# EAGLE design dac-eval-simplified (EAGLE 7.3.0)

## Sheet 1 of 2
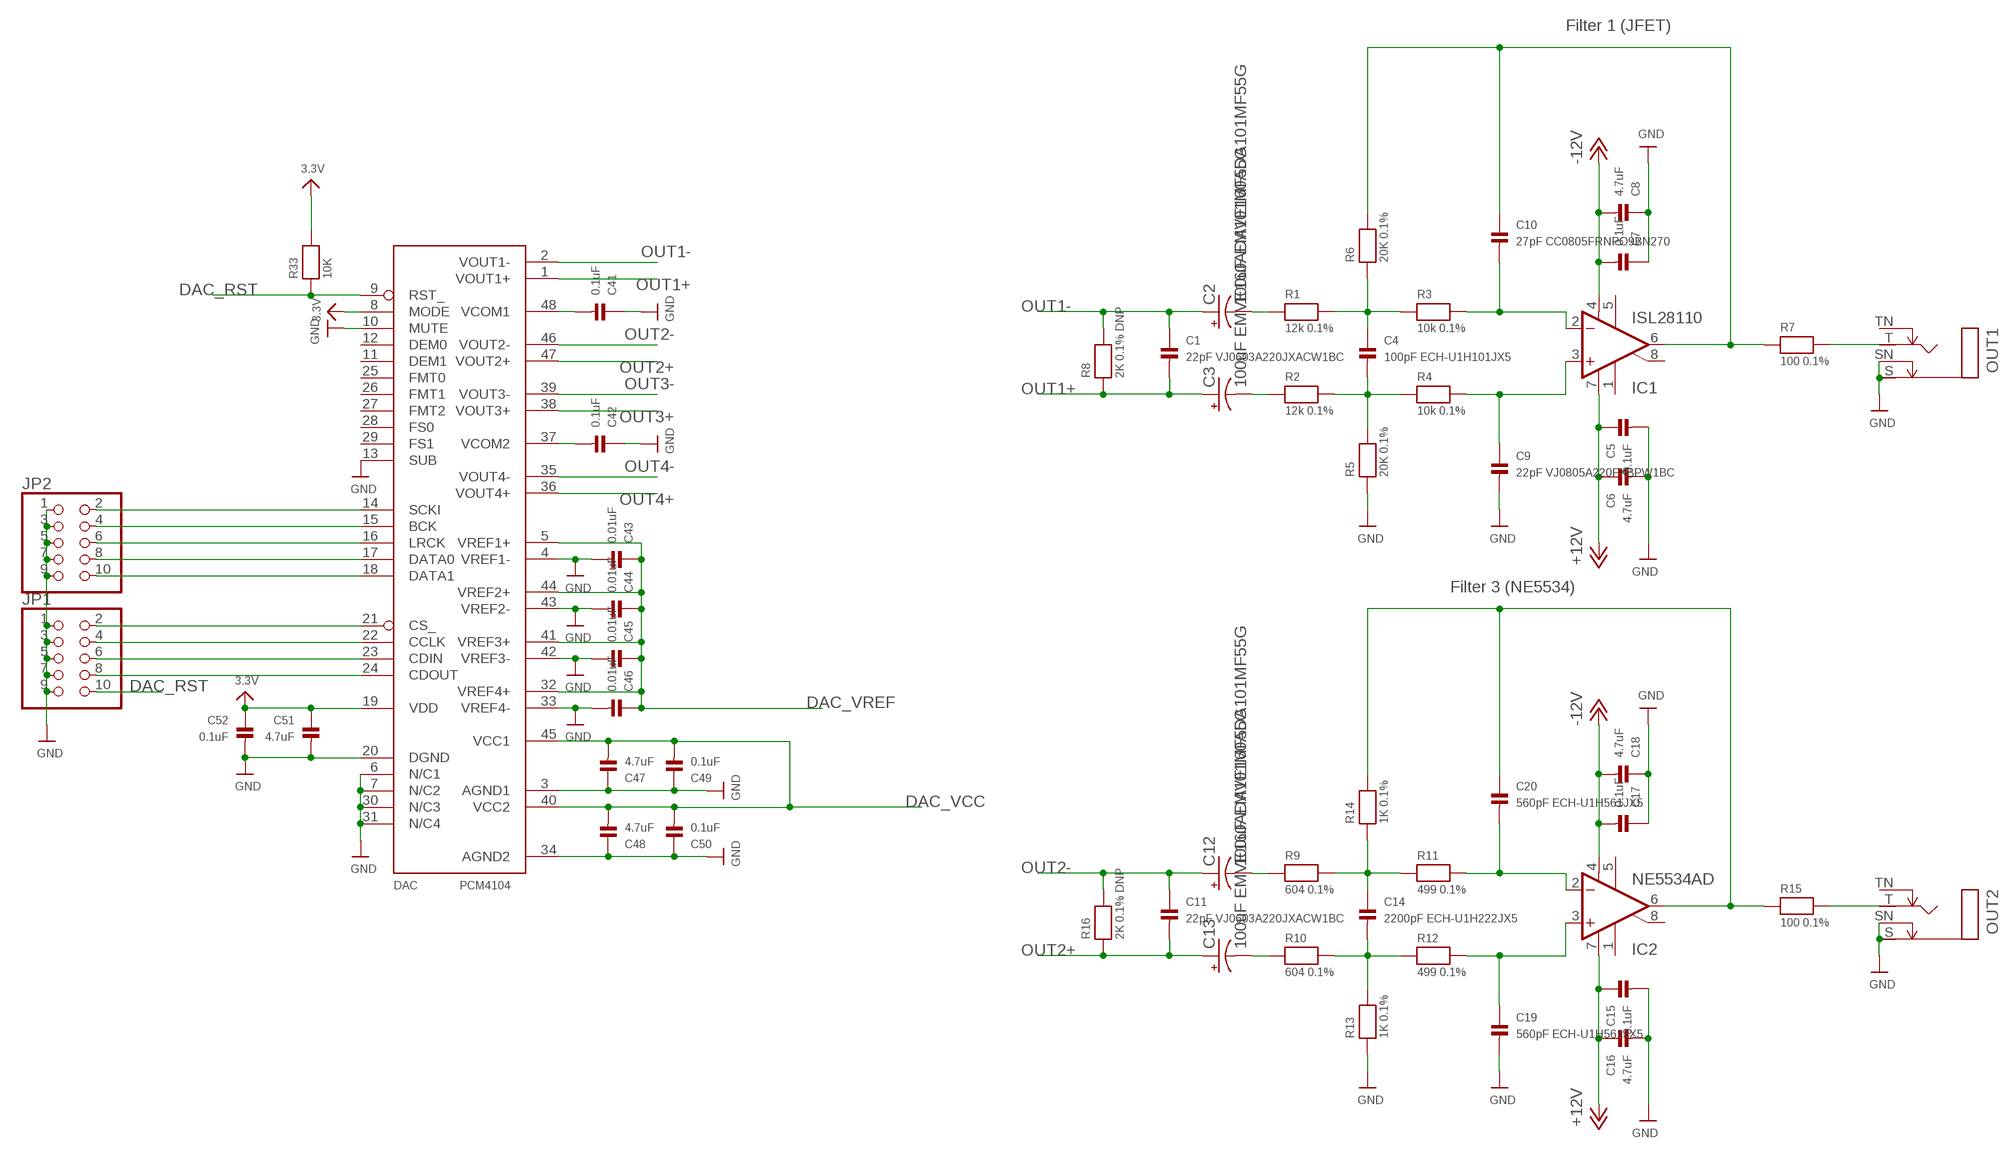
[diagram p0: schematic, sheet 1, part 1 of 2]
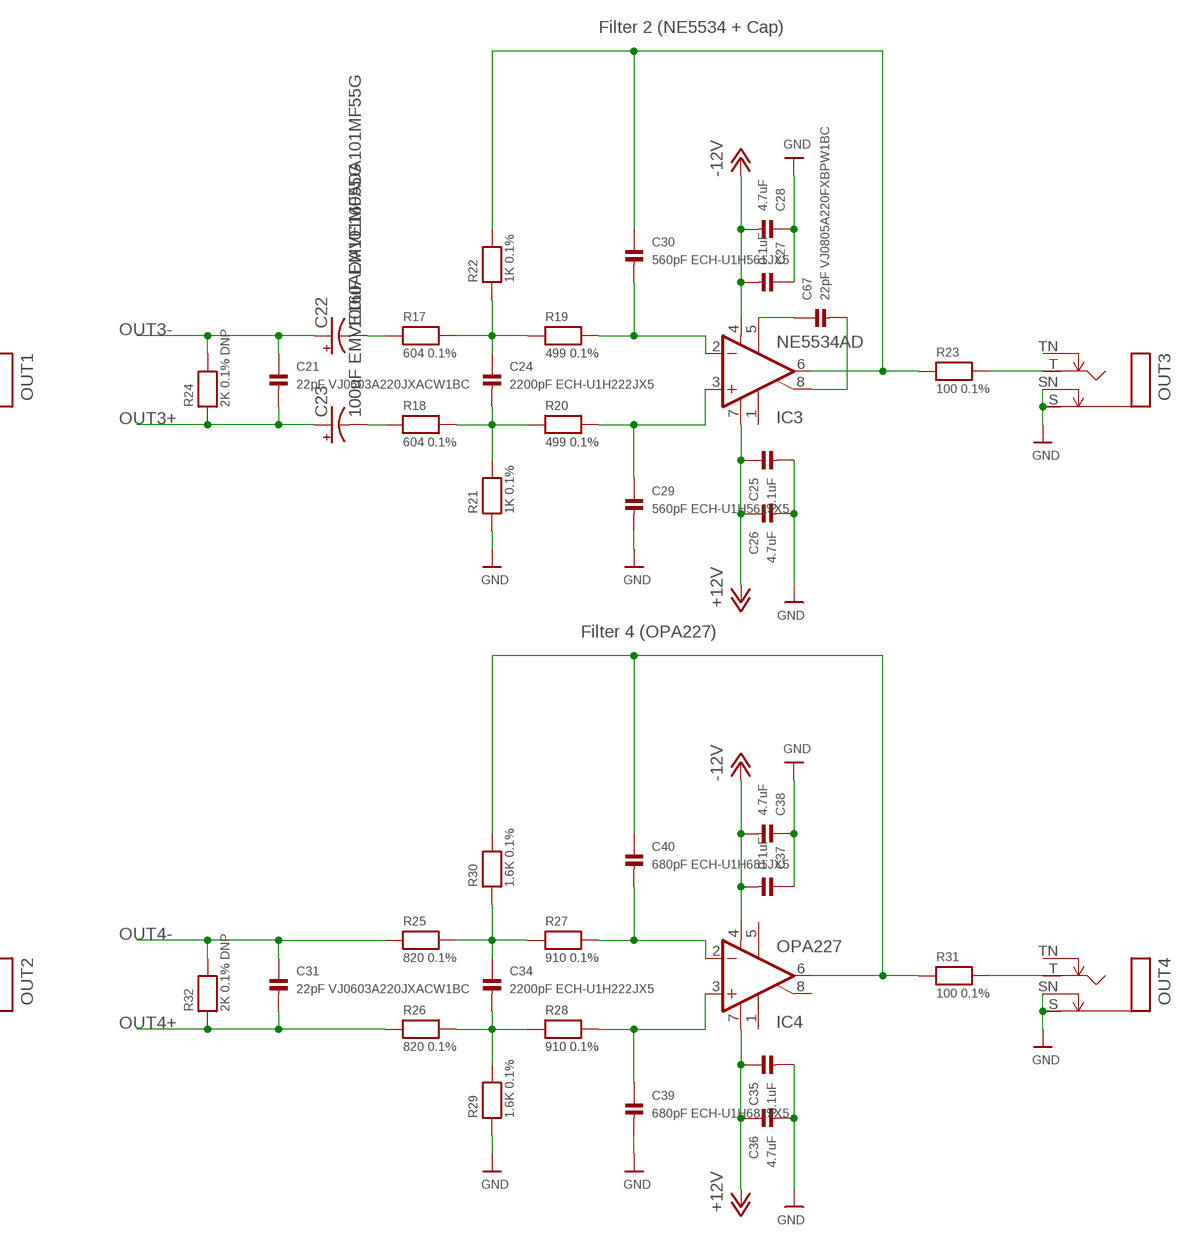
[diagram p1: schematic, sheet 1, part 2 of 2]

### Parts
C1  22pF VJ0603A220JXACW1BC  CAP_CERAMIC0603  [0603]
C2  100uF EMVE160ADA101MF55G  CAP_POLD  [PANASONIC_D]
C3  100uF EMVE160ADA101MF55G  CAP_POLD  [PANASONIC_D]
C4  100pF ECH-U1H101JX5  CAP_CERAMIC0805  [0805]
C5  0.1uF  CAP_CERAMIC0603  [0603]
C6  4.7uF  CAP_CERAMIC0603  [0603]
C7  0.1uF  CAP_CERAMIC0603  [0603]
C8  4.7uF  CAP_CERAMIC0603  [0603]
C9  22pF VJ0805A220FXBPW1BC  CAP_CERAMIC0805  [0805]
C10  27pF CC0805FRNPO9BN270  CAP_CERAMIC0805  [0805]
C11  22pF VJ0603A220JXACW1BC  CAP_CERAMIC0603  [0603]
C12  100uF EMVE160ADA101MF55G  CAP_POLD  [PANASONIC_D]
C13  100uF EMVE160ADA101MF55G  CAP_POLD  [PANASONIC_D]
C14  2200pF ECH-U1H222JX5  CAP_CERAMIC0805  [0805]
C15  0.1uF  CAP_CERAMIC0603  [0603]
C16  4.7uF  CAP_CERAMIC0603  [0603]
C17  0.1uF  CAP_CERAMIC0603  [0603]
C18  4.7uF  CAP_CERAMIC0603  [0603]
C19  560pF ECH-U1H561JX5  CAP_CERAMIC0805  [0805]
C20  560pF ECH-U1H561JX5  CAP_CERAMIC0805  [0805]
C21  22pF VJ0603A220JXACW1BC  CAP_CERAMIC0603  [0603]
C22  100uF EMVE160ADA101MF55G  CAP_POLD  [PANASONIC_D]
C23  100uF EMVE160ADA101MF55G  CAP_POLD  [PANASONIC_D]
C24  2200pF ECH-U1H222JX5  CAP_CERAMIC0805  [0805]
C25  0.1uF  CAP_CERAMIC0603  [0603]
C26  4.7uF  CAP_CERAMIC0603  [0603]
C27  0.1uF  CAP_CERAMIC0603  [0603]
C28  4.7uF  CAP_CERAMIC0603  [0603]
C29  560pF ECH-U1H561JX5  CAP_CERAMIC0805  [0805]
C30  560pF ECH-U1H561JX5  CAP_CERAMIC0805  [0805]
C31  22pF VJ0603A220JXACW1BC  CAP_CERAMIC0603  [0603]
C34  2200pF ECH-U1H222JX5  CAP_CERAMIC0805  [0805]
C35  0.1uF  CAP_CERAMIC0603  [0603]
C36  4.7uF  CAP_CERAMIC0603  [0603]
C37  0.1uF  CAP_CERAMIC0603  [0603]
C38  4.7uF  CAP_CERAMIC0603  [0603]
C39  680pF ECH-U1H681JX5  CAP_CERAMIC0805  [0805]
C40  680pF ECH-U1H681JX5  CAP_CERAMIC0805  [0805]
C41  0.1uF  CAP_CERAMIC0603  [0603]
C42  0.1uF  CAP_CERAMIC0603  [0603]
C43  0.01uF  CAP_CERAMIC0603  [0603]
C44  0.01uF  CAP_CERAMIC0603  [0603]
C45  0.01uF  CAP_CERAMIC0603  [0603]
C46  0.01uF  CAP_CERAMIC0603  [0603]
C47  4.7uF  CAP_CERAMIC0603  [0603]
C48  4.7uF  CAP_CERAMIC0603  [0603]
C49  0.1uF  CAP_CERAMIC0603  [0603]
C50  0.1uF  CAP_CERAMIC0603  [0603]
C51  4.7uF  CAP_CERAMIC0603  [0603]
C52  0.1uF  CAP_CERAMIC0603  [0603]
C67  22pF VJ0805A220FXBPW1BC  CAP_CERAMIC0805  [0805]
DAC  PCM4104  [SQFP-S-7X7-48]
IC1  ISL28110  NE5534AD  [SO08]
IC2  NE5534AD  [SO08]
IC3  NE5534AD  [SO08]
IC4  OPA227  NE5534AD  [SO08]
JP1  HEADER-2X5  [2X05]
JP2  HEADER-2X5  [2X05]
OUT1  NMJ4HFD2  MONOSWS  [NMJ4HC-S]
OUT2  NMJ4HFD2  MONOSWS  [NMJ4HC-S]
OUT3  NMJ4HFD2  MONOSWS  [NMJ4HC-S]
OUT4  NMJ4HFD2  MONOSWS  [NMJ4HC-S]
R1  12k 0.1%  RESISTOR0603  [0603]
R2  12k 0.1%  RESISTOR0603  [0603]
R3  10k 0.1%  RESISTOR0603  [0603]
R4  10k 0.1%  RESISTOR0603  [0603]
R5  20K 0.1%  RESISTOR0603  [0603]
R6  20K 0.1%  RESISTOR0603  [0603]
R7  100 0.1%  RESISTOR0603  [0603]
R8  2K 0.1% DNP  RESISTOR0603  [0603]
R9  604 0.1%  RESISTOR0603  [0603]
R10  604 0.1%  RESISTOR0603  [0603]
R11  499 0.1%  RESISTOR0603  [0603]
R12  499 0.1%  RESISTOR0603  [0603]
R13  1K 0.1%  RESISTOR0603  [0603]
R14  1K 0.1%  RESISTOR0603  [0603]
R15  100 0.1%  RESISTOR0603  [0603]
R16  2K 0.1% DNP  RESISTOR0603  [0603]
R17  604 0.1%  RESISTOR0603  [0603]
R18  604 0.1%  RESISTOR0603  [0603]
R19  499 0.1%  RESISTOR0603  [0603]
R20  499 0.1%  RESISTOR0603  [0603]
R21  1K 0.1%  RESISTOR0603  [0603]
R22  1K 0.1%  RESISTOR0603  [0603]
R23  100 0.1%  RESISTOR0603  [0603]
R24  2K 0.1% DNP  RESISTOR0603  [0603]
R25  820 0.1%  RESISTOR0603  [0603]
R26  820 0.1%  RESISTOR0603  [0603]
R27  910 0.1%  RESISTOR0603  [0603]
R28  910 0.1%  RESISTOR0603  [0603]
R29  1.6K 0.1%  RESISTOR0603  [0603]
R30  1.6K 0.1%  RESISTOR0603  [0603]
R31  100 0.1%  RESISTOR0603  [0603]
R32  2K 0.1% DNP  RESISTOR0603  [0603]
R33  10K  RESISTOR0603  [0603]

### Nets
3.3V: C51.1 C52.1 DAC.8(MODE) DAC.19(VDD) R33.2 ; also sheet 2
+12V: C5.1 C6.1 C15.1 C16.1 C25.1 C26.1 C35.1 C36.1 IC1.7(V+) IC2.7(V+) IC3.7(V+) IC4.7(V+) ; also sheet 2
-12V: C7.2 C8.2 C17.2 C18.2 C27.2 C28.2 C37.2 C38.2 IC1.4(V-) IC2.4(V-) IC3.4(V-) IC4.4(V-) ; also sheet 2
DAC_BCK: DAC.15(BCK) JP2.4
DAC_CLK: DAC.22(CCLK) JP1.4
DAC_CS: DAC.21(CS_) JP1.2
DAC_D0: DAC.17(DATA0) JP2.8
DAC_D1: DAC.18(DATA1) JP2.10
DAC_LRCK: DAC.16(LRCK) JP2.6
DAC_MISO: DAC.24(CDOUT) JP1.8
DAC_MOSI: DAC.23(CDIN) JP1.6
DAC_RST: DAC.9(RST_) JP1.10 R33.1
DAC_SCK: DAC.14(SCKI) JP2.2
DAC_VCC: C47.2 C48.2 C49.2 C50.2 DAC.40(VCC2) DAC.45(VCC1) ; also sheet 2
DAC_VREF: C43.1 C44.1 C45.1 C46.1 DAC.5(VREF1+) DAC.32(VREF4+) DAC.41(VREF3+) DAC.44(VREF2+) ; also sheet 2
GND: C5.2 C6.2 C7.1 C8.1 C9.2 C15.2 C16.2 C17.1 C18.1 C19.2 C25.2 C26.2 C27.1 C28.1 C29.2 C35.2 C36.2 C37.1 C38.1 C39.2 C41.1 C42.1 C43.2 C44.2 C45.2 C46.2 C47.1 C48.1 C49.1 C50.1 C51.2 C52.2 DAC.3(AGND1) DAC.4(VREF1-) DAC.6(N/C1) DAC.7(N/C2) DAC.10(MUTE) DAC.13(SUB) DAC.20(DGND) DAC.30(N/C3) DAC.31(N/C4) DAC.33(VREF4-) DAC.34(AGND2) DAC.42(VREF3-) DAC.43(VREF2-) JP1.1 JP1.3 JP1.5 JP1.7 JP1.9 JP2.1 JP2.3 JP2.5 JP2.7 JP2.9 OUT1.S OUT1.SN OUT2.S OUT2.SN OUT3.S OUT3.SN OUT4.S OUT4.SN R5.1 R13.1 R21.1 R29.1 ; also sheet 2
N$1: C12.- R9.1
N$2: C13.- R10.1
N$3: C2.- R1.1
N$4: C3.- R2.1
N$5: C4.2 R2.2 R4.1 R5.2
N$6: C4.1 R1.2 R3.1 R6.1
N$7: C14.2 R10.2 R12.1 R13.2
N$8: C9.1 IC1.3(+IN) R4.2
N$9: C10.2 IC1.2(-IN) R3.2
N$10: C10.1 IC1.6(OUT) R6.2 R7.1
N$11: C14.1 R9.2 R11.1 R14.1
N$12: OUT1.T R7.2
N$13: C19.1 IC2.3(+IN) R12.2
N$14: C20.2 IC2.2(-IN) R11.2
N$15: C20.1 IC2.6(OUT) R14.2 R15.1
N$16: OUT2.T R15.2
N$17: C22.- R17.1
N$18: C23.- R18.1
N$19: C24.2 R18.2 R20.1 R21.2
N$20: C24.1 R17.2 R19.1 R22.1
N$21: C29.1 IC3.3(+IN) R20.2
N$22: C30.2 IC3.2(-IN) R19.2
N$23: C30.1 IC3.6(OUT) R22.2 R23.1
N$24: OUT3.T R23.2
N$27: C34.2 R26.2 R28.1 R29.2
N$28: C34.1 R25.2 R27.1 R30.1
N$29: C39.1 IC4.3(+IN) R28.2
N$30: C40.2 IC4.2(-IN) R27.2
N$31: C40.1 IC4.6(OUT) R30.2 R31.1
N$32: OUT4.T R31.2
N$33: C41.2 DAC.48(VCOM1)
N$34: C42.2 DAC.37(VCOM2)
N$35: C67.1 IC3.5(CMP)
N$36: C67.2 IC3.8(ON/CMP)
OUT1+: C1.2 C3.+ DAC.1(VOUT1+) R8.1
OUT1-: C1.1 C2.+ DAC.2(VOUT1-) R8.2
OUT2+: C11.2 C13.+ DAC.47(VOUT2+) R16.1
OUT2-: C11.1 C12.+ DAC.46(VOUT2-) R16.2
OUT3+: C21.2 C23.+ DAC.38(VOUT3+) R24.1
OUT3-: C21.1 C22.+ DAC.39(VOUT3-) R24.2
OUT4+: C31.2 DAC.36(VOUT4+) R26.1 R32.1
OUT4-: C31.1 DAC.35(VOUT4-) R25.1 R32.2
Unconnected: DAC.11(DEM1) DAC.12(DEM0) DAC.25(FMT0) DAC.26(FMT1) DAC.27(FMT2) DAC.28(FS0) DAC.29(FS1) IC1.1(ON) IC1.5(CMP) IC1.8(ON/CMP) IC2.1(ON) IC2.5(CMP) IC2.8(ON/CMP) IC3.1(ON) IC4.1(ON) IC4.5(CMP) IC4.8(ON/CMP) OUT1.TN OUT2.TN OUT3.TN OUT4.TN

### Notes on the sheet
- Filter 1 (JFET) | Filter 2 (NE5534 + Cap)
- Filter 3 (NE5534) | Filter 4 (OPA227)

## Sheet 2 of 2
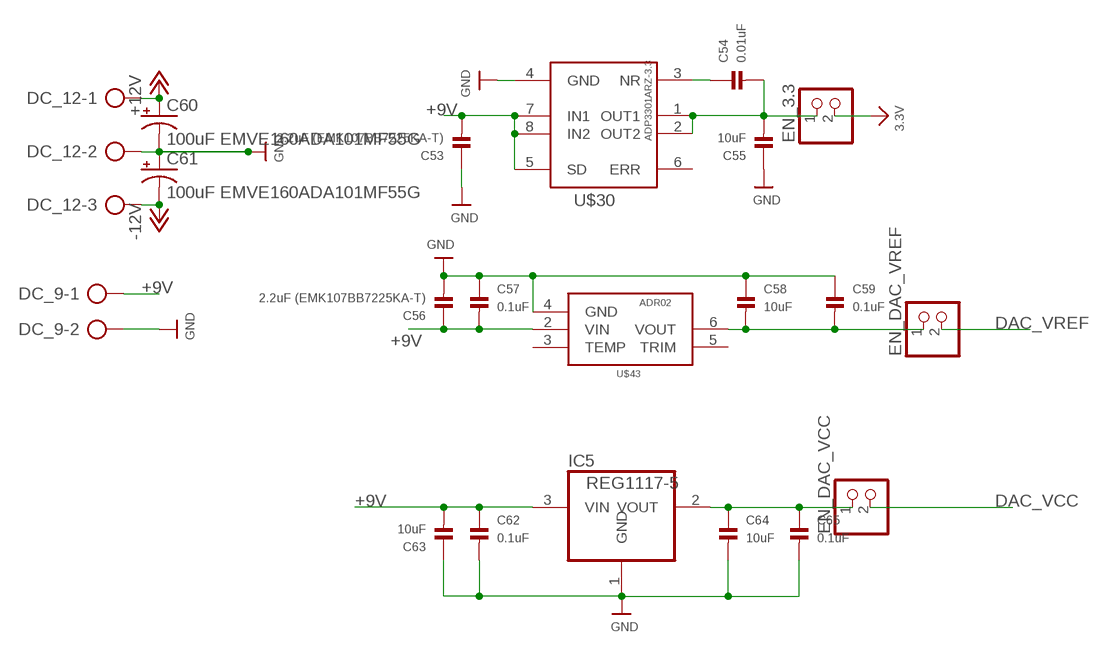
[diagram p2: schematic, sheet 2]

### Parts
C53  2.2uF (EMK107BB7225KA-T)  CAP_CERAMIC0603  [0603]
C54  0.01uF  CAP_CERAMIC0603  [0603]
C55  10uF  CAP_CERAMIC0603  [0603]
C56  2.2uF (EMK107BB7225KA-T)  CAP_CERAMIC0603  [0603]
C57  0.1uF  CAP_CERAMIC0603  [0603]
C58  10uF  CAP_CERAMIC0603  [0603]
C59  0.1uF  CAP_CERAMIC0603  [0603]
C60  100uF EMVE160ADA101MF55G  CAP_POLD  [PANASONIC_D]
C61  100uF EMVE160ADA101MF55G  CAP_POLD  [PANASONIC_D]
C62  0.1uF  CAP_CERAMIC0603  [0603]
C63  10uF  CAP_CERAMIC0603  [0603]
C64  10uF  CAP_CERAMIC0603  [0603]
C65  0.1uF  CAP_CERAMIC0603  [0603]
DC_9  AK500/2  [AK500/2]
DC_12  AK500/3  [AK500/3]
EN_3.3  HEADER-1X2  [1X02_OVAL]
EN_DAC_VCC  HEADER-1X2  [1X02_OVAL]
EN_DAC_VREF  HEADER-1X2  [1X02_OVAL]
IC5  REG1117-5  REG1117  [SOT223]
U$30  ADP3301ARZ-3.3  ADP3301  [SO08]
U$43  ADR02  [SOIC8]

### Nets
3.3V: EN_3.3.2 ; also sheet 1
+9V: C53.2 C56.1 C57.2 C62.1 C63.2 DC_9.1 IC5.3(VIN) U$30.5(SD) U$30.7(IN1) U$30.8(IN2) U$43.2(VIN)
+12V: C60.+ DC_12.1 ; also sheet 1
-12V: C61.- DC_12.3 ; also sheet 1
DAC_VCC: EN_DAC_VCC.2 ; also sheet 1
DAC_VREF: EN_DAC_VREF.2 ; also sheet 1
GND: C53.1 C55.1 C56.2 C57.1 C58.1 C59.1 C60.- C61.+ C62.2 C63.1 C64.2 C65.2 DC_9.2 DC_12.2 IC5.1(GND) U$30.4(GND) U$43.4(GND) ; also sheet 1
N$46: C54.2 C55.2 EN_3.3.1 U$30.1(OUT1) U$30.2(OUT2)
N$47: C54.1 U$30.3(NR)
N$48: C58.2 C59.2 EN_DAC_VREF.1 U$43.6(VOUT)
N$51: C64.1 C65.1 EN_DAC_VCC.1 IC5.2(VOUT)
Unconnected: U$30.6(ERR) U$43.3(TEMP) U$43.5(TRIM)

## Library data of the parts
C1 C4-C11 C14-C21 C24-C31 C34-C59 C62-C65 C67 = microbuilder:CAP_CERAMIC: Ceramic Capacitors 0402 - 0402 Surface Mount Capacitors 16pF 50V 5% [Digikey: 445-4899-2-ND] 18pF 50V 5% [Digikey: 490-1281-2-ND] 22pF 50V 5% [Digikey: 490-1283-2-ND] 68pF 50V 5% [Digikey: 490-1289-2-ND] 0.1uF 10V 10% [Digikey: 490-1318-2-ND] 1.0uF 6.3V 10% [Digikey: 490-1320-2-ND] 0603 - 0603 Surface Mount Capacitors 16 pF 50V 5% [Digikey: 445-5051-2-ND] 22 pF 50V [Digikey: PCC220ACVTR-ND] 33 pF 50V 5% [Digikey: 490-1415-1-ND] 56pF 50V 5% [Digikey: 490-1421-1-ND] 220pF 50V 5% [Digikey: 445-1285-1-ND] 680 pF 50V 2200 pF 50V 5% C0G [Digikey: 445-1297-1-ND] 5600 pF 100V 5% X7R [Digikey: 478-3711-1-ND] 0.1 µF 25V 10% [Digikey: PCC2277TR-ND] 0.22 µF 16V 10% X7R [Digikey: 445-1318-1-ND] 1.0 µF 25V 10% [Digikey: 445-5146-2-ND] 0603 - RF Specific 3pF 250V +/-0.1pF RF [Digikey: 712-1347-1-ND] 18 pF 250V 5% [Digikey: 478-3505-1-ND or 712-1322-1-ND] 56 pF 250V 5% C0G RF [Digikey: 490-4867-1-ND] 68 pF 250V RF [Digikey: 490-4868-1-ND] 0805 - 0805 Surface Mount Capacitors 220 pF 250V 2% RF Ceramic Capacitor [Digikey: 712-1398-1-ND] 1000 pF 50V 2% NP0 Ceramic Capacitor [Digikey: 478-3760-1-ND] 0.1 µF 25V 10% Ceramic Capacitor [Digikey: PCC1828TR-ND] 1.0 µF 16V 10% Ceramic Capacitor[Digikey: 490-1691-2-ND] 10.0 µF 10V 10% Ceramic Capacitor[Digikey: 709-1228-1-ND] 10.0 uF 16V 10% Ceramic Capacitor [Digikey: 478-5165-2-ND] 47 uF 6.3V 20% Ceramic Capacitor [Digikey: 587-1779-1-ND or 399-5506-1-ND] 1206 - 1206 Surface Mount Capacitors 47uF 10V 20% Ceramic Capacitor [Digikey: 490-5528-1-ND or 399-5508-1-ND or 445-6010-1-ND] 100uF 6.3V -20%, +80% Y5V Ceramic Capacitor (Digikey: 490-4512-1-ND, Mouser: 81-GRM31CF50J107ZE1L)
C2 C3 C12 C13 C22 C23 C60 C61 = SparkFun-Capacitors:CAP_POL: Capacitor Polarized These are standard SMD and PTH capacitors. Normally 10uF, 47uF, and 100uF in electrolytic and tantalum varieties. Always verify the external diameter of the through hole cap, it varies with capacity, voltage, and manufacturer. The EIA devices should be standard.
DAC = BurrBrownAudioParts:PCM4104: PCM4104: High-Performance 118dB, 24-Bit, 216kHz Sampling, Four-Channel Audio D/A Converter
DC_9 = con-ptr500:AK500/2: CONNECTOR; OC_FARNELL: unknown; OC_NEWARK: unknown
DC_12 = con-ptr500:AK500/3: CONNECTOR; OC_FARNELL: unknown; OC_NEWARK: unknown
EN_3.3 EN_DAC_VCC EN_DAC_VREF = microbuilder:HEADER-1X2: PIN HEADER
IC1-IC4 = linear:NE5534: LOW-NOISE OPERATIONAL AMPLIFIER Source: http://focus.ti.com/lit/ds/symlink/ne5534.pdf
IC5 = burr-brown:REG1117: 800mA and 1A Low Dropout (LDO) Positive Regulator 1.8V, 2.5V, 2.85V, 3.3V, 5V, and Adj; MPN: REG1117; OC_FARNELL: 1097566; OC_NEWARK: 14P6981
JP1 JP2 = microbuilder:HEADER-2X5: PIN HEADER
OUT1-OUT4 = pl-jacks:MONOSW
R1-R33 = microbuilder:RESISTOR: Resistors 0402 - 0402 Surface Mount Package 22 Ohm 1% 1/16W [Digikey: 311-22.0LRTR-ND] 33 Ohm 5% 1/16W 1.0K 5% 1/16W 1.5K 5% 1/16W 2.0K 1% 1/16W 10.0K 1% 1/16W [Digikey: 311-10.0KLRTR-ND] 10.0K 5% 1/16W [Digikey: RMCF0402JT10K0TR-ND] 12.1K 1% 1/16W [Digikey: 311-22.0LRTR-ND] 100.0K 5% 1/16W 0603 - 0603 Surface Mount Package 0 Ohm 1/10 Watt 1% Resistor 15 Ohm 1/10 Watt 1% Resistor 33 Ohm 1/10 Watt 1% Resistor 49.9 Ohm 1/10 Watt 1% Resistor 100 Ohm 1/10 Watt 1% Resistor 150 Ohm 1/10 Watt 1% Resistor 240 Ohm 1/10 Watt 1% Resistor 390 Ohm 1/10 Watt 1% Resistor 560 Ohm 1/10 Watt 1% Resistor 680 Ohm 1/10 Watt 1% Resistor 750 Ohm 1/10 Watt 1% Resistor 1.0K Ohm 1/10 Watt 1% Resistor 1.5K Ohm 1/10 Watt 1% Resistor 2.0K Ohm 1/10 Watt 1% Resistor 2.2K Ohm 1/10 Watt 1% Resistor 3.3K Ohm 1/10 Watt 1% Resistor 4.7K Ohm 1/10 Watt 1% Resistor 10.0K Ohm 1/10 Watt 1% Resistor 12.0K Ohm 1/10 Watt 1% Resistor 12.1K Ohm 1/10 Watt 1% Resistor 20.0K Ohm 1/10 Watt 1% Resistor 33.0K Ohm 1/10 Watt 1% Resistor 100.0K Ohm 1/10 Watt 1% Resistor 0805 - 0805 Surface Mount Package 0 Ohm 1/8 Watt 1% Resistor 33 Ohm 1/8 Watt 1% Resistor 100 Ohm 1/8 Watt 1% Resistor 150 Ohm 1/8 Watt 1% Resistor 200 Ohm 1/8 Watt 1% Resistor 240 Ohm 1/8 Watt 1% Resistor 330 Ohm 1/8 Watt 1% Resistor 390 Ohm 1/8 Watt 1% Resistor 470 Ohm 1/8 Watt 1% Resistor 1.0K Ohm 1/8 Watt 1% Resistor 1.5K Ohm 1/8 Watt 1% Resistor 2.0K Ohm 1/8 Watt 1% Resistor 4.7K Ohm 1/8 Watt 1% Resistor 5.1K Ohm 1/8 Watt 1% Resistor 5.6K Ohm 1/8 Watt 1% Resistor 10.0K Ohm 1/8 Watt 1% Resistor 22.0K Ohm 1/8 Watt 1% Resistor 33.0K Ohm 1/8 Watt 1% Resistor 100K Ohm 1/8 Watt 1% Resistor 1206 - 1206 Surface Mount Package 2012 - 2010 Surface Mount Package 0.11 Ohm 1/2 Watt 1% Resistor - Digikey: RHM.11UCT-ND
U$30 = keves:ADP3301
U$43 = keves:ADR02

## Board
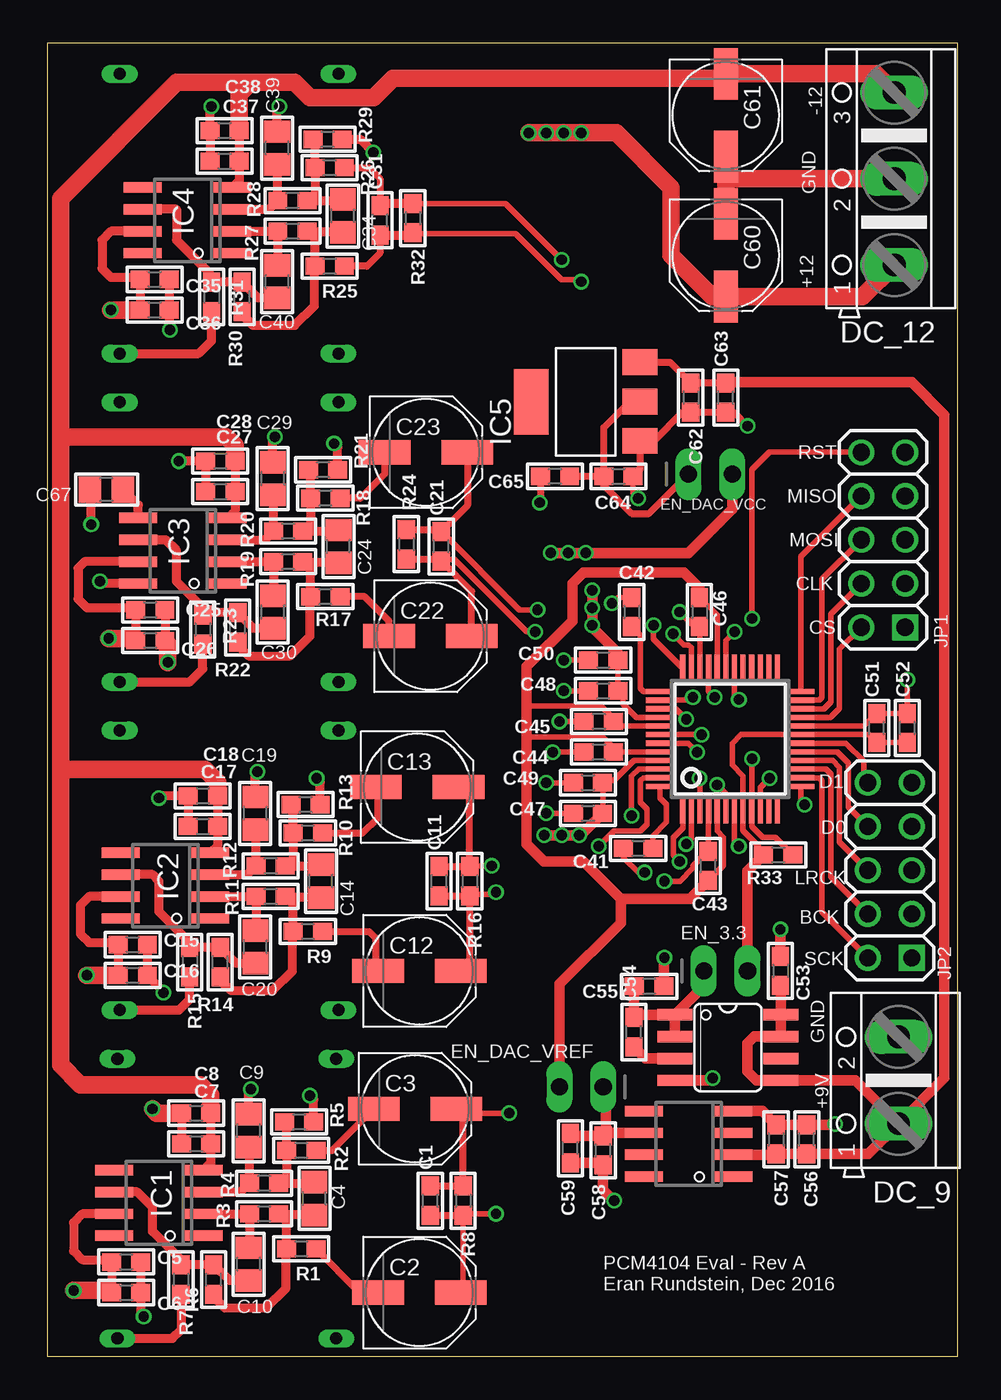
[diagram p3: board, top side]
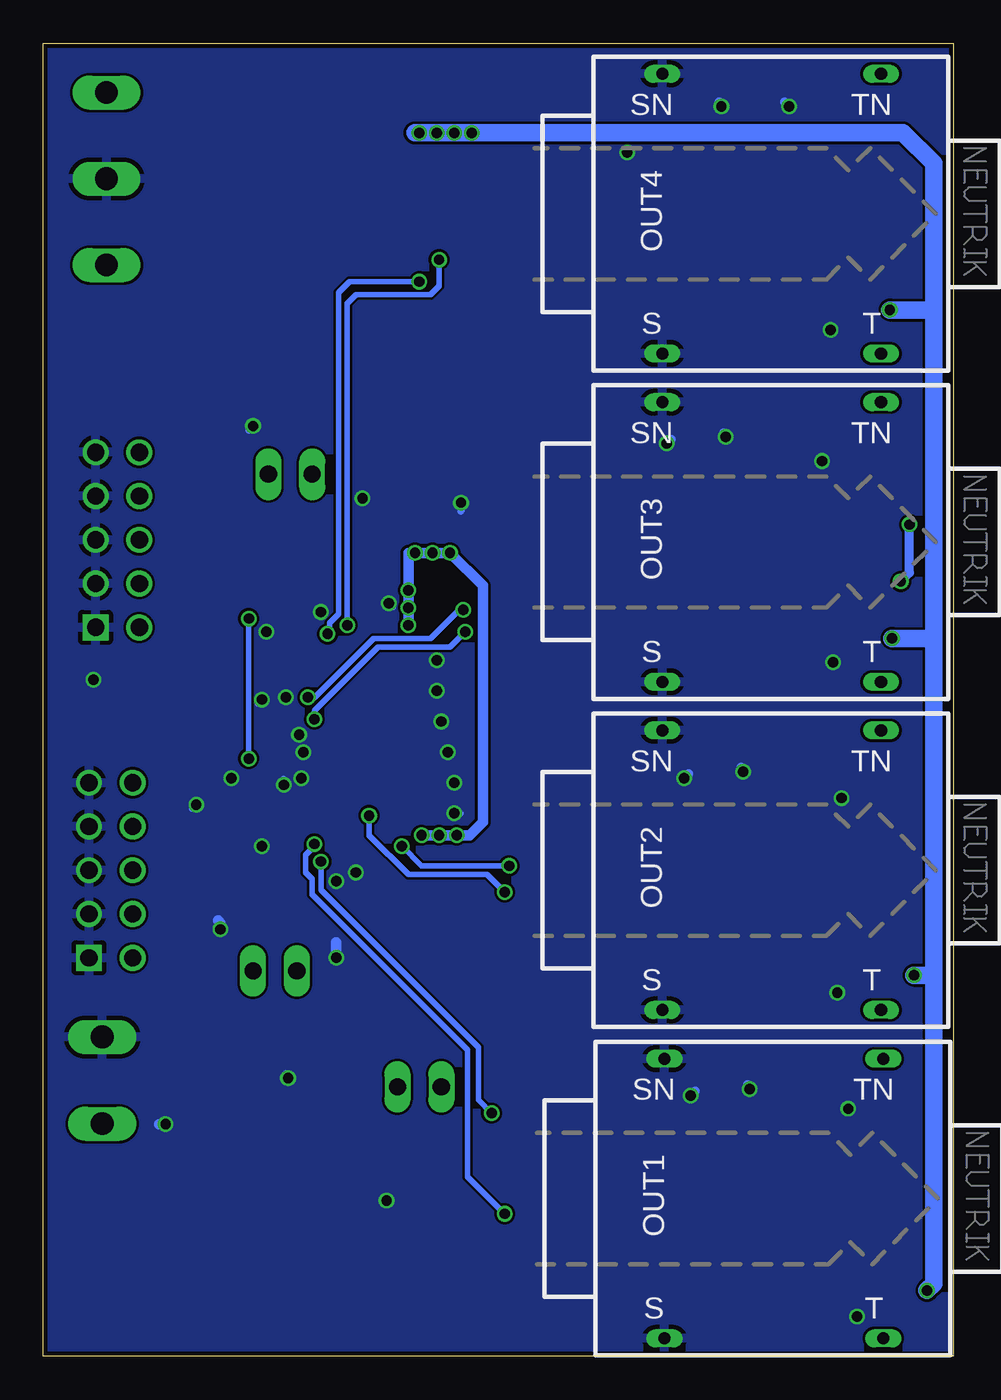
[diagram p4: board, bottom side, seen from below]

Size 52.83 x 76.2 mm. Coordinates in mm from the lower left corner, seen from the top.
Outline: 0,0 52.83,0 52.83,76.2 0,76.2 0,0
Copper layers (1*16): Top 0.035mm / dielectric 1.5mm / Bottom 0.035mm
Design rules "MacroFab_Standard_2_Layer *": minimum track width 6mil, minimum drill 12mil, track to track 6mil, track to pad 6mil, pad to pad 6mil, via to via 6mil, smd to smd 0mil, copper to edge 10mil, drill to drill 10mil, minimum pad ring 6mil, minimum via ring 6mil, stop-mask expansion 2mil, vias tented up to drill 25mil, thermal gap 10mil

### Footprints (pad centres in the part's own frame; a part is rotated, then mirrored left to right if it is on the bottom)
0603 = smd 1.1 x 1: 1 -0.85,0; 2 0.85,0
PANASONIC_D = smd 3 x 1.4: + 2.4,0; - -2.4,0
0805 = smd 1.3 x 1.5: 1 -0.95,0; 2 0.95,0
SQFP-S-7X7-48 = smd 0.3 x 1.6: 1 -2.75,-4.1; 2 -2.25,-4.1; 3 -1.75,-4.1; 4 -1.25,-4.1; 5 -0.75,-4.1; 6 -0.25,-4.1; 7 0.25,-4.1; 8 0.75,-4.1; 9 1.25,-4.1; 10 1.75,-4.1; 11 2.25,-4.1; 12 2.75,-4.1; 25 2.75,4.1; 26 2.25,4.1; 27 1.75,4.1; 28 1.25,4.1; 29 0.75,4.1; 30 0.25,4.1; 31 -0.25,4.1; 32 -0.75,4.1; 33 -1.25,4.1; 34 -1.75,4.1; 35 -2.25,4.1; 36 -2.75,4.1 | smd 1.6 x 0.3: 13 4.1,-2.75; 14 4.1,-2.25; 15 4.1,-1.75; 16 4.1,-1.25; 17 4.1,-0.75; 18 4.1,-0.25; 19 4.1,0.25; 20 4.1,0.75; 21 4.1,1.25; 22 4.1,1.75; 23 4.1,2.25; 24 4.1,2.75; 37 -4.1,2.75; 38 -4.1,2.25; 39 -4.1,1.75; 40 -4.1,1.25; 41 -4.1,0.75; 42 -4.1,0.25; 43 -4.1,-0.25; 44 -4.1,-0.75; 45 -4.1,-1.25; 46 -4.1,-1.75; 47 -4.1,-2.25; 48 -4.1,-2.75
AK500/2 = drill 1.321 long: 1 -2.515,0; 2 2.515,0
AK500/3 = drill 1.321 long: 1 -5.004,0; 2 0,0; 3 5.004,0
1X02_OVAL = drill 1 long: 1 -1.27,0; 2 1.27,0
SO08 = smd 0.6 x 2.2: 1 -1.905,-2.6; 2 -0.635,-2.6; 3 0.635,-2.6; 4 1.905,-2.6; 5 1.905,2.6; 6 0.635,2.6; 7 -0.635,2.6; 8 -1.905,2.6
SOT223 = smd 1.499 x 2.007: 1 -2.261,-3.15; 2 0.025,-3.15; 3 2.311,-3.15 | smd 3.81 x 2.007: 4 0,3.15
2X05 = drill 1 square: 1 -5.08,-1.27 | drill 1: 2 -5.08,1.27; 3 -2.54,-1.27; 4 -2.54,1.27; 5 0,-1.27; 6 0,1.27; 7 2.54,-1.27; 8 2.54,1.27; 9 5.08,-1.27; 10 5.08,1.27
NMJ4HC-S = drill 0.7 long: S 5.08,8.115; SN 5.08,-8.115; T -7.62,8.115; TN -7.62,-8.115
SO08' = smd 0.66 x 2.032: 1 -1.905,-3.073; 2 -0.635,-3.073; 3 0.635,-3.073; 4 1.905,-3.073; 5 1.905,3.073; 6 0.635,3.073; 7 -0.635,3.073; 8 -1.905,3.073
SOIC8 = smd 0.6 x 2.2: 1 -1.905,-2.6; 2 -0.635,-2.6; 3 0.635,-2.6; 4 1.905,-2.6; 5 1.905,2.6; 6 0.635,2.6; 7 -0.635,2.6; 8 -1.905,2.6

### Placement (x,y rotation side)
C1  22.23,9.02 90 top
C2  21.59,3.68 0 top
C3  21.34,14.35 0 top
C4  15.49,9.14 90 top
C5  4.57,5.46 0 top
C6  4.57,3.68 0 top
C7  8.64,12.32 0 top
C8  8.64,14.1 0 top
C9  11.68,13.08 90 top
C10  11.68,5.33 90 top
C11  22.73,27.56 90 top
C12  21.59,22.35 0 top
C13  21.46,33.02 0 top
C14  15.88,27.56 90 top
C15  4.95,23.88 0 top
C16  4.95,22.1 0 top
C17  9.02,30.73 0 top
C18  9.02,32.51 0 top
C19  12.06,31.5 90 top
C20  12.06,23.75 90 top
C21  22.86,46.99 90 top
C22  22.23,41.78 0 top
C23  21.97,52.45 0 top
C24  16.89,46.99 90 top
C25  5.97,43.31 0 top
C26  5.97,41.53 0 top
C27  10.03,50.16 0 top
C28  10.03,51.94 0 top
C29  13.08,50.93 90 top
C30  13.08,43.18 90 top
C31  19.3,65.91 90 top
C34  17.14,66.17 90 top
C35  6.22,62.48 0 top
C36  6.22,60.71 0 top
C37  10.29,69.34 0 top
C38  10.29,71.12 0 top
C39  13.34,70.1 90 top
C40  13.34,62.36 90 top
C41  34.29,29.46 0 top
C42  33.91,43.18 270 top
C43  38.35,28.45 90 top
C44  32,35.05 180 top
C45  32,36.83 180 top
C46  37.85,43.18 270 top
C47  31.37,31.5 0 top
C48  32.26,38.61 0 top
C49  31.37,33.27 0 top
C50  32.26,40.39 0 top
C51  48.13,36.45 90 top
C52  49.91,36.45 90 top
C53  42.55,22.35 270 top
C54  34.04,18.8 90 top
C55  34.92,21.46 180 top
C56  44.07,12.57 90 top
C57  42.29,12.57 270 top
C58  32.26,11.94 90 top
C59  30.35,12.06 90 top
C60  39.37,63.88 270 top
C61  39.37,72.01 270 top
C62  37.34,55.63 270 top
C63  39.37,55.63 90 top
C64  33.15,51.05 0 top
C65  29.46,51.05 180 top
C67  3.43,50.29 180 top
DAC  39.62,35.81 0 top
DC_9  49.4,16 90 top
DC_12  49.15,68.33 90 top
EN_3.3  39.37,22.35 0 top
EN_DAC_VCC  38.48,51.18 0 top
EN_DAC_VREF  30.99,15.62 180 top
IC1  6.48,8.89 90 top
IC2  6.86,27.3 90 top
IC3  7.87,46.74 90 top
IC4  8.13,65.91 90 top
IC5  31.24,55.37 90 top
JP1  48.51,47.37 90 top
JP2  48.9,28.19 90 top
OUT1  11.68,9.14 180 bottom
OUT2  11.81,28.19 180 bottom
OUT3  11.81,47.24 180 bottom
OUT4  11.81,66.29 180 bottom
R1  14.73,6.22 180 top
R2  14.73,11.94 180 top
R3  12.57,8.26 180 top
R4  12.57,10.03 180 top
R5  14.61,13.59 180 top
R6  9.65,4.45 90 top
R7  7.75,4.45 270 top
R8  24.13,9.02 270 top
R9  15.11,24.64 180 top
R10  15.11,30.35 180 top
R11  12.95,26.67 180 top
R12  12.95,28.45 180 top
R13  14.99,32 180 top
R14  10.03,22.86 90 top
R15  8.26,22.86 270 top
R16  24.51,27.56 270 top
R17  16.13,44.07 180 top
R18  16.13,49.78 180 top
R19  13.97,46.1 180 top
R20  13.97,47.88 180 top
R21  16,51.44 180 top
R22  11.05,42.29 90 top
R23  9.02,42.16 270 top
R24  20.83,47.12 270 top
R25  16.38,63.25 180 top
R26  16.38,68.96 180 top
R27  14.22,65.28 180 top
R28  14.22,67.06 180 top
R29  16.26,70.61 180 top
R30  11.3,61.47 90 top
R31  9.53,61.47 270 top
R32  21.21,66.04 270 top
R33  42.42,29.08 180 top
U$30  ADP3301ARZ-3.3  [SO08']  39.5,17.91 270 top
U$43  37.21,12.32 90 top

### Tracks (layer width: path | path; a pad name or v marks a point on that pad's centre or on a via)
3.3V
  Top 0.305: C52.1 C51.1 47.67,36.06 DAC.19 40.26,36.07 39.75,35.56 39.75,34.29 40.37,33.67 DAC.8 40.37,30.49 41.27,29.59 41.27,29.38 R33.2
  Top 0.61: EN_3.3.2 40.64,28.16 R33.2
+9V
  Top 0.406: 42.57,21.48 C53.2 | C63.2 C62.1 36.13,57.68 IC5.3
  Top 0.61: 42.57,21.48 U$30.8 U$30.7 41.02,18.54 40.64,18.16 40.64,16.51 41.15,16 U$30.5 46.89,16 DC_9.1 | U$43.2 42.25,11.68 C57.2 C56.1 47.64,11.72 DC_9.1 | C63.2 39.41,56.52 50.16,56.52 52.07,54.61 52.07,16.15 DC_9.1
+12V  (via drill 0.6)
  Top 0.508: IC1.7 2.03,8.26 1.52,7.75 1.52,6.1 2.03,5.59 3.6,5.59 C5.1 C6.1 | IC4.7 3.68,65.28 3.17,64.77 3.17,63.12 3.68,62.61 5.25,62.61 C35.1 C36.1 | C26.1 C25.1 4.99,43.43 2.29,43.43 1.78,43.94 1.78,45.72 2.16,46.1 IC3.7 | IC2.7 2.41,26.67 1.91,26.16 1.91,24.51 2.41,24 3.98,24 C15.1 C16.1
  Top 1.016: v1.52,3.81 3.6,3.81 C6.1 | C16.1 v2.29,22.1 | v3.56,41.66 4.99,41.66 C26.1 | C36.1 v3.68,60.71 | v27.94,70.99 v28.96,70.99 v29.97,70.99 v30.99,70.99 33.02,70.99 36.2,67.82 36.2,63.88 38.59,61.48 C60.+ 47.31,61.48 DC_12.1
  Bottom 1.016: 31.24,70.99 v30.99,70.99 v29.97,70.99 v28.96,70.99 v27.94,70.99 2.92,70.99 1.14,69.22 1.14,60.71 | 1.14,60.71 1.14,41.78 | 1.14,41.78 1.14,22.1 | 1.14,22.1 1.14,4.19 v1.52,3.81 | v2.29,22.1 1.14,22.1 | v3.68,60.71 1.14,60.71 | v3.56,41.66 1.27,41.66 1.14,41.78
-12V
  Top 0.305: C38.2 11.05,71.21
  Top 0.508: C8.2 C7.2 9.49,11.2 IC1.4 | C38.2 C37.2 11.14,68.23 IC4.4 | C28.2 C27.2 10.88,49.05 IC3.4 | C18.2 C17.2 9.87,29.62 IC2.4
  Top 1.016: C8.2 9.49,15.15 8.89,15.75 1.91,15.75 0.76,16.89 0.76,34.04 | DC_12.3 48.07,74.41 C61.- 39.13,74.17 20.07,74.17 18.92,73.03 15.24,73.03 14.35,73.91 11.81,73.91 | 0.76,34.04 0.76,53.34 | 0.76,53.34 0.76,67.18 7.49,73.91 11.81,73.91 | C28.2 10.88,52.87 10.41,53.34 0.76,53.34 | C18.2 9.87,33.31 9.14,34.04 0.76,34.04 | C38.2 11.14,73.24 11.81,73.91
DAC_BCK
  Top 0.305: DAC.15 45.18,34.06 45.47,33.78 45.47,27.81 JP2.4
DAC_CLK
  Top 0.305: DAC.22 45.06,37.56 45.47,37.97 45.47,43.05 JP1.4
DAC_CS
  Top 0.305: DAC.21 45.45,37.06 45.97,37.59 45.97,41.02 JP1.2
DAC_D0
  Top 0.305: DAC.17 45.84,35.06 46.48,34.42 46.48,31.88 JP2.8
DAC_D1
  Top 0.305: DAC.18 46.35,35.56 47.37,34.54 47.37,33.53 JP2.10
DAC_LRCK
  Top 0.305: DAC.16 45.57,34.56 45.97,34.16 45.97,29.84 JP2.6
DAC_MISO
  Top 0.305: DAC.24 43.72,46.39 JP1.8
DAC_MOSI
  Top 0.305: DAC.23 44.8,38.06 44.96,38.23 44.96,45.09 JP1.6
DAC_RST  (via drill 0.6)
  Top 0.305: JP1.10 41.91,52.45 40.89,51.44 v40.89,42.8 | v40.89,34.67 40.89,31.73 | 40.89,31.73 DAC.9 | 40.89,31.73 40.89,30.73 41.53,30.1 42.25,30.1 R33.1
  Bottom 0.305: v40.89,42.8 v40.89,34.67
DAC_SCK
  Top 0.305: DAC.14 44.8,33.56 44.96,33.4 44.96,25.78 JP2.2
DAC_VCC  (via drill 0.6)
  Top 0.305: C50.2 C48.2 33.4,38.31 33.4,37.85 34.18,37.06 DAC.40 | 32.28,32.79 32.26,32.77 | 32.26,32.77 32.26,33.23 C49.2 32.35,33.4 32.89,33.4 34.06,34.56 DAC.45 | 32.26,32.77 32.26,31.54 C47.2
  Top 0.406: C50.2 33.11,40.81 | 31.62,42.29 v31.62,42.42
  Top 0.61: 33.11,40.81 31.62,42.29 | v31.62,42.42 v31.62,43.43 v31.62,44.45 | v29.21,46.61 v30.23,46.61 v31.24,46.61 37.21,46.61 39.75,49.15 EN_DAC_VCC.2 | C47.2 30.95,30.23 v30.86,30.23 v29.84,30.23 v28.83,30.23
  Bottom 0.61: v31.62,42.42 v31.62,43.43 v31.62,44.45 31.62,46.61 v31.24,46.61 v30.23,46.61 v29.21,46.61 27.3,44.7 27.3,30.99 28.07,30.23 v29.84,30.23 v30.86,30.23 30.95,30.23
DAC_VREF
  Top 0.305: DAC.32 38.87,43 C46.1 | DAC.41 33.12,36.56 C45.1 32.85,37 32.13,37.72 27.94,37.72 27.81,37.85 | DAC.5 38.87,30.47 39.24,30.1 39.24,28.49 C43.1 | C44.1 32.87,35.06 DAC.44 33.13,35.06 32.26,35.94 27.94,35.94 27.81,36.07
  Top 0.406: C46.1 37.85,44.58
  Top 0.61: 37.85,44.58 36.96,45.47 31.11,45.47 30.48,44.83 30.48,42.67 27.81,40.01 27.81,37.85 27.81,36.07 27.81,29.72 28.83,28.7 31.11,28.7 33.27,26.54 | 33.27,26.54 37.3,26.54 C43.1 | 33.27,26.54 33.27,25.15 29.72,21.59 EN_DAC_VREF.2
GND  (via drill 0.6)
  Top 0.305: DAC.20 47.4,36.56 C51.2 C52.2 v49.91,39.24 | C43.2 38.37,29.32 DAC.4 38.37,29.36 37.47,28.45 37.47,28.32 36.7,27.56 v35.81,27.56 | DAC.34 37.87,42.3 C46.2 37.55,42.33 v36.7,43.18 | DAC.33 38.37,38.59 v38.73,38.23 | DAC.42 v37.97,36.06 v37.97,36.07 | DAC.43 37.21,35.56 v37.72,35.05 | C42.1 33.11,44.03 v32.77,43.69 | C50.1 v29.97,40.39 | C48.1 v29.97,38.61 | C45.2 v29.72,36.83 | C49.1 v28.96,33.27 | C47.1 v28.96,31.5 | C41.1 33.44,28.92 34.29,28.07 v34.67,28.07 | DAC.3 37.87,33.5 v37.85,33.53 | DAC.30 39.87,38.36 v40.13,38.1 | DAC.6 39.37,32.63 v38.86,33.15 | DAC.31 39.37,41.53 v39.88,42.04 | C44.2 v29.34,35.05 | DAC.7 39.87,29.85 v40.13,29.59 | DAC.13 43.72,32.22 v43.94,32 | DAC.10 41.37,32.99 v41.91,33.53 | C64.2 34,50.08 v34.29,49.78
  Top 0.406: C65.2 28.61,49.57 v28.57,49.53 | C64.2 34.39,51.45 IC5.1 34.42,53.09 35.18,53.09 36.87,54.78 C62.2 C63.1 39.84,54.78 v40.64,53.98
  Top 0.508: C8.1 C7.1 | C5.2 C6.2 5.42,2.45 v5.59,2.29 | R5.1 15.46,14.9 v15.24,15.11 | C9.2 11.68,15.37 v11.81,15.49 | C37.1 C38.1 9.44,72.43 v9.53,72.52 | C35.2 C36.2 7.07,59.6 v7.11,59.56 | C39.2 13.34,72.39 v13.46,72.52 | C27.1 C28.1 v7.62,51.94 | C25.2 C26.2 | R21.1 16.85,52.74 v16.64,52.96 | C29.2 13.08,53.21 v13.21,53.34 | C17.1 C18.1 6.6,32.51 v6.48,32.38 | C15.2 C16.2 6.73,21.17 v6.73,21.08 | R13.1 15.84,33.31 v15.62,33.53 | C19.2 12.06,33.78 v12.19,33.91 | R29.1 18.16,70.61 v18.92,69.85
  Top 0.61: C53.1 v42.55,24.77 | U$30.4 38.48,16 v38.61,16.13 | v45.72,13.46 45.68,13.42 C56.2 C57.1 41.49,14.22 U$43.4 | C59.1 32.13,11.21 C58.1 32.26,9.65 v32.89,9.02 | C55.1 35.77,23.07 v35.81,23.11
  Top 1.016: C8.1 6.35,14.1 v6.1,14.35 | v6.99,40.26 6.99,41.36 C26.2 | C61.+ 39.37,68.58 | 39.37,68.58 C60.- | DC_12.2 39.62,68.33 39.37,68.58
  Bottom 0.305: v38.73,38.23 38.86,38.1 | v37.97,36.07 38.1,36.07 | v37.72,35.05 37.85,34.92 | 36.45,43.05 36.45,43.18 | v32.77,43.69 32.51,43.43 | v29.97,40.39 29.72,40.39 | v28.96,33.27 28.7,33.27 | v28.96,31.5 28.57,31.5 | v34.67,28.07 34.92,28.07 | v37.85,33.53 37.85,33.78 | v40.13,38.1 40.39,37.85 | v38.86,33.15 38.86,33.53 | v39.88,42.04 40.13,42.04 | v29.34,35.05 29.08,35.05 | v40.13,29.59 40.26,29.46 | v43.94,32 44.2,31.75 | v41.91,33.53 41.91,33.78
  Bottom 0.406: v42.55,24.77 42.55,25.15 | 38.61,16.26 38.73,16.38 | v28.57,49.53 28.57,49.02 | v40.64,53.98 40.89,53.72
  Bottom 0.508: v15.24,15.11 14.99,15.37 | v11.81,15.49 11.81,15.62 11.94,15.75 | v9.53,72.52 9.78,72.77 | v13.46,72.52 13.46,72.64 13.59,72.77 | v16.64,52.96 16.38,53.21 | v13.21,53.34 13.21,53.47 13.34,53.59 | v15.62,33.53 15.37,33.78 | v12.19,33.91 12.19,34.04 12.32,34.16
  Bottom 0.61: 42.55,25.15 42.67,25.27 | v38.61,16.13 38.61,16.26 | v45.72,13.46 46.1,13.46 | v35.81,23.11 35.81,24
  pour Bottom: 0.38,76.2 52.58,76.2 52.58,0.51 0.25,0.51 0.25,18.29
N$1
  Top 0.406: R9.1 18.67,24.64 19.05,24.26 19.05,22.49 C12.-
N$2
  Top 0.406: R10.1 18.29,30.35 19.18,31.24 19.18,32.91 C13.-
N$3
  Top 0.406: C2.- 18.12,3.68 R1.1
N$4
  Top 0.406: R2.1 16.52,11.94 C3.-
N$5
  Top 0.508: R4.1 13.97,10.03 | 13.97,10.03 15.43,10.03 C4.2 | 13.97,10.03 13.88,10.12 R2.2 13.88,13.46 R5.2
N$6
  Top 0.508: C4.1 13.97,8.19 | 13.97,8.19 13.48,8.19 R3.1 | 13.97,8.19 13.88,8.11 R1.2 13.84,6.18 13.84,3.94 12.7,2.79 10.29,2.79 9.65,3.43 R6.1
N$7
  Top 0.508: R12.1 14.35,28.45 | 14.35,28.45 15.81,28.45 C14.2 | 14.35,28.45 14.26,28.54 R10.2 14.26,31.88 R13.2
N$8
  Top 0.508: IC1.3 11.21,9.53 R4.2 11.72,12.09 C9.1
N$9
  Top 0.508: IC1.2 R3.2 11.72,6.32 C10.2
N$10
  Top 0.508: C10.1 10.56,4.38 R6.2 R7.1 7.75,5.59 6.1,7.24 6.1,8.64 5.21,9.53 IC1.6
N$11
  Top 0.508: C14.1 14.35,26.61 | 14.35,26.61 13.87,26.61 R11.1 | 14.35,26.61 14.26,26.52 R9.2 14.22,24.6 14.22,22.35 13.08,21.21 10.67,21.21 10.03,21.84 R14.1
N$12
  Top 0.508: R7.2 7.75,1.52 7.25,1.03 OUT1.T
N$13
  Top 0.508: IC2.3 11.6,27.94 R12.2 12.1,30.51 C19.1
N$14
  Top 0.508: IC2.2 R11.2 12.1,24.74 C20.2
N$15
  Top 0.508: C20.1 10.94,22.8 R14.2 | R14.2 R15.1 | R14.2 8.55,23.71 6.48,25.78 6.48,27.56 6.1,27.94 IC2.6
N$16
  Top 0.508: OUT2.T 7.63,20.08 8.26,20.7 R15.2
N$17
  Top 0.406: C22.- 19.82,42.66 18.41,44.07 R17.1
N$18
  Top 0.406: C23.- 19.57,51.19 18.16,49.78 R18.1
N$19
  Top 0.508: R20.1 15.37,47.88 | 15.37,47.88 16.83,47.88 C24.2 | 15.37,47.88 15.28,47.97 R18.2 15.28,51.31 R21.2
N$20
  Top 0.508: C24.1 15.37,46.04 | 15.37,46.04 14.88,46.04 R19.1 | 15.37,46.04 15.28,45.95 R17.2 15.24,44.03 15.24,41.78 14.1,40.64 11.68,40.64 11.05,41.27 R22.1
N$21
  Top 0.508: IC3.3 12.61,47.37 R20.2 13.12,49.94 C29.1
N$22
  Top 0.508: IC3.2 R19.2 13.12,44.17 C30.2
N$23
  Top 0.508: C30.1 11.96,42.23 R22.2 9.14,43.14 | 9.14,43.14 R23.1 | 9.14,43.14 9.14,43.31 7.49,44.96 7.49,46.74 6.86,47.37 IC3.6
N$24
  Top 0.508: OUT3.T 8.27,39.13 9.02,39.88 R23.2
N$27
  Top 0.508: R28.1 15.62,67.06 | 15.62,67.06 17.08,67.06 C34.2 | 15.62,67.06 15.53,67.14 R26.2 15.53,70.48 R29.2
N$28
  Top 0.508: C34.1 15.62,65.22 | 15.62,65.22 15.13,65.22 R27.1 | 15.62,65.22 15.53,65.13 R25.2 15.49,63.21 15.49,60.96 14.35,59.82 11.94,59.82 11.3,60.45 R30.1
N$29
  Top 0.508: IC4.3 12.87,66.55 R28.2 13.37,69.11 C39.1
N$30
  Top 0.508: IC4.2 R27.2 13.37,63.35 C40.2
N$31
  Top 0.508: IC4.6 7.49,66.55 7.49,64.77 9.4,62.87 9.4,62.45 R31.1 R30.2 12.21,61.41 C40.1
N$32
  Top 0.508: OUT4.T 8.78,58.18 9.53,58.93 R31.2
N$33
  Top 0.305: DAC.48 35.56,33.03 35.56,32.38 35.94,32 35.94,30.99 35.14,30.19 C41.2
N$34
  Top 0.305: DAC.37 34.59,38.56 34.42,38.73 34.42,41.82 C42.2
N$35
  Top 0.508: IC3.5 5.27,49.4 C67.1
N$36  (via drill 0.6)
  Top 0.508: IC3.8 3.17,44.83 v3.05,44.96 | v2.54,48.26 2.54,50.23 C67.2
  Bottom 0.508: v3.05,44.96 2.54,45.47 v2.54,48.26
N$46
  Top 0.406: 34.2,19.81 C54.2 | 34.04,21.42 C55.2
  Top 0.61: U$30.1 U$30.2 | U$30.1 34.2,19.81 | C54.2 34.04,21.42 | EN_3.3.1 38.1,21.49 U$30.1
N$47
  Top 0.61: U$30.3 34.71,17.27 C54.1
N$48
  Top 0.61: U$43.6 32.42,12.95 | 32.42,12.95 C58.2 30.48,12.79 C59.2 | 32.42,12.95 32.42,15.46 EN_DAC_VREF.1
N$51
  Top 0.406: C64.1 C65.1 | C64.1 32.3,53.89 33.78,55.37 34.37,55.37 IC5.2 | C64.1 32.3,50.51 33.91,48.9 34.92,48.9 EN_DAC_VCC.1
OUT1+  (via drill 0.6)
  Top 0.305: DAC.1 36.87,30.65 36.32,30.1 36.32,29.08 v36.7,28.7 | v26.8,14.1 23.99,14.1 C3.+
  Top 0.406: C1.2 R8.1 24.13,13.96 C3.+
  Bottom 0.305: v36.7,28.7 36.7,27.05 27.56,17.91 27.56,14.86 v26.8,14.1
OUT1-  (via drill 0.6)
  Top 0.305: DAC.2 37.37,30.01 v37.08,29.72 | v26.04,8.26 24.22,8.26 R8.2 24.13,3.82 C2.+
  Top 0.406: C1.1 R8.2
  Bottom 0.305: v37.08,29.72 37.08,29.59 37.59,29.08 37.59,28.07 37.21,27.69 37.21,26.8 28.19,17.78 28.19,10.41 v26.04,8.26
OUT2+  (via drill 0.6)
  Top 0.305: DAC.47 34.58,33.56 34.42,33.4 34.42,32.13 34.8,31.75 34.8,30.86 34.42,30.48 32.89,30.48 v32,29.59 | v25.78,28.45 24.55,28.45 R16.1
  Top 0.406: C11.2 R16.1 24.51,32.37 C13.+
  Bottom 0.305: v32,29.59 30.86,28.45 v25.78,28.45
OUT2-  (via drill 0.6)
  Top 0.305: DAC.46 34.32,34.06 33.91,33.66 v33.91,31.37 | R16.2 24.6,26.8 25.91,26.8 v26.04,26.92
  Top 0.406: C11.1 R16.2 24.51,22.87 C12.+
  Bottom 0.305: v33.91,31.37 33.91,30.23 31.62,27.94 27.05,27.94 v26.04,26.92
OUT3+  (via drill 0.6)
  Top 0.305: DAC.38 37.3,38.06 v37.47,38.23 | C21.2 27.39,43.31 v28.45,43.31
  Top 0.406: R24.1 22.73,47.97 C21.2 24.37,49.35 C23.+
  Bottom 0.305: v37.47,38.23 37.08,38.23 33.66,41.66 30.35,41.66 28.7,43.31 v28.45,43.31
OUT3-  (via drill 0.6)
  Top 0.305: DAC.39 36.48,37.56 v37.08,36.96 | 24.88,42.04 24.62,42.29 | v28.32,42.04 27.81,42.04 23.62,46.23 22.95,46.23 C21.1
  Top 0.406: R24.2 22.73,46.27 C21.1 24.62,44.38 24.62,42.29 C22.+
  Bottom 0.305: v37.08,36.96 37.08,37.47 33.4,41.15 29.21,41.15 v28.32,42.04
OUT4+  (via drill 0.6)
  Top 0.305: 36.87,40.09 DAC.36 35.18,41.61 v35.18,42.42 | R32.1 26.58,66.89 v29.84,63.63
  Top 0.406: R26.1 18.67,68.96 19.3,68.33 C31.2
  Top 0.508: R32.1 19.43,66.89 C31.2
  Bottom 0.305: v29.84,63.63 29.84,62.1 30.35,61.59 34.67,61.59 35.18,61.09 v35.18,42.42
OUT4-  (via drill 0.6)
  Top 0.305: DAC.35 37.37,41.11 37.21,41.27 36.96,41.27 v36.32,41.91 | R32.2 21.25,65.15 27.18,65.15 29.84,62.48 30.86,62.48 v30.99,62.36
  Top 0.406: C31.1 19.3,64.01 18.54,63.25 R25.1
  Top 0.508: C31.1 21.08,65.06 R32.2
  Bottom 0.305: v36.32,41.91 36.2,42.04 36.2,42.55 35.69,43.05 35.69,61.72 35.05,62.36 v30.99,62.36

### Text on the board
tPlace: -12 | GND | +12 | RST | MISO | MOSI | CLK | CS | D1 | D0 | LRCK | BCK | SCK | GND | +9V | PCM4104 Eval - Rev A / Eran Rundstein, Dec 2016